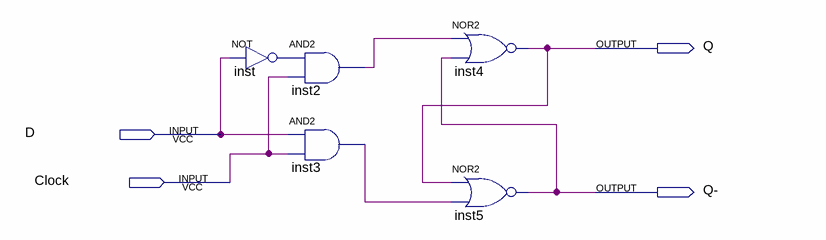
[diagram p0: schematic sheet]
// Quartus schematic DFlip.bdf as structural Verilog: 5 symbols, 4 pins
module DFlip (
  input  D,
  input  Clock,
  output Q,
  output \Q- 
);

  wire inst2_out, inst3_out, inst_out;

  not inst (inst_out, D);
  and inst2 (inst2_out, inst_out, Clock);
  and inst3 (inst3_out, D, Clock);
  nor inst4 (Q, inst2_out, \Q- );
  nor inst5 (\Q- , Q, inst3_out);
endmodule
